# EAGLE design FlightComputerBoard1 (EAGLE 8.1.0)
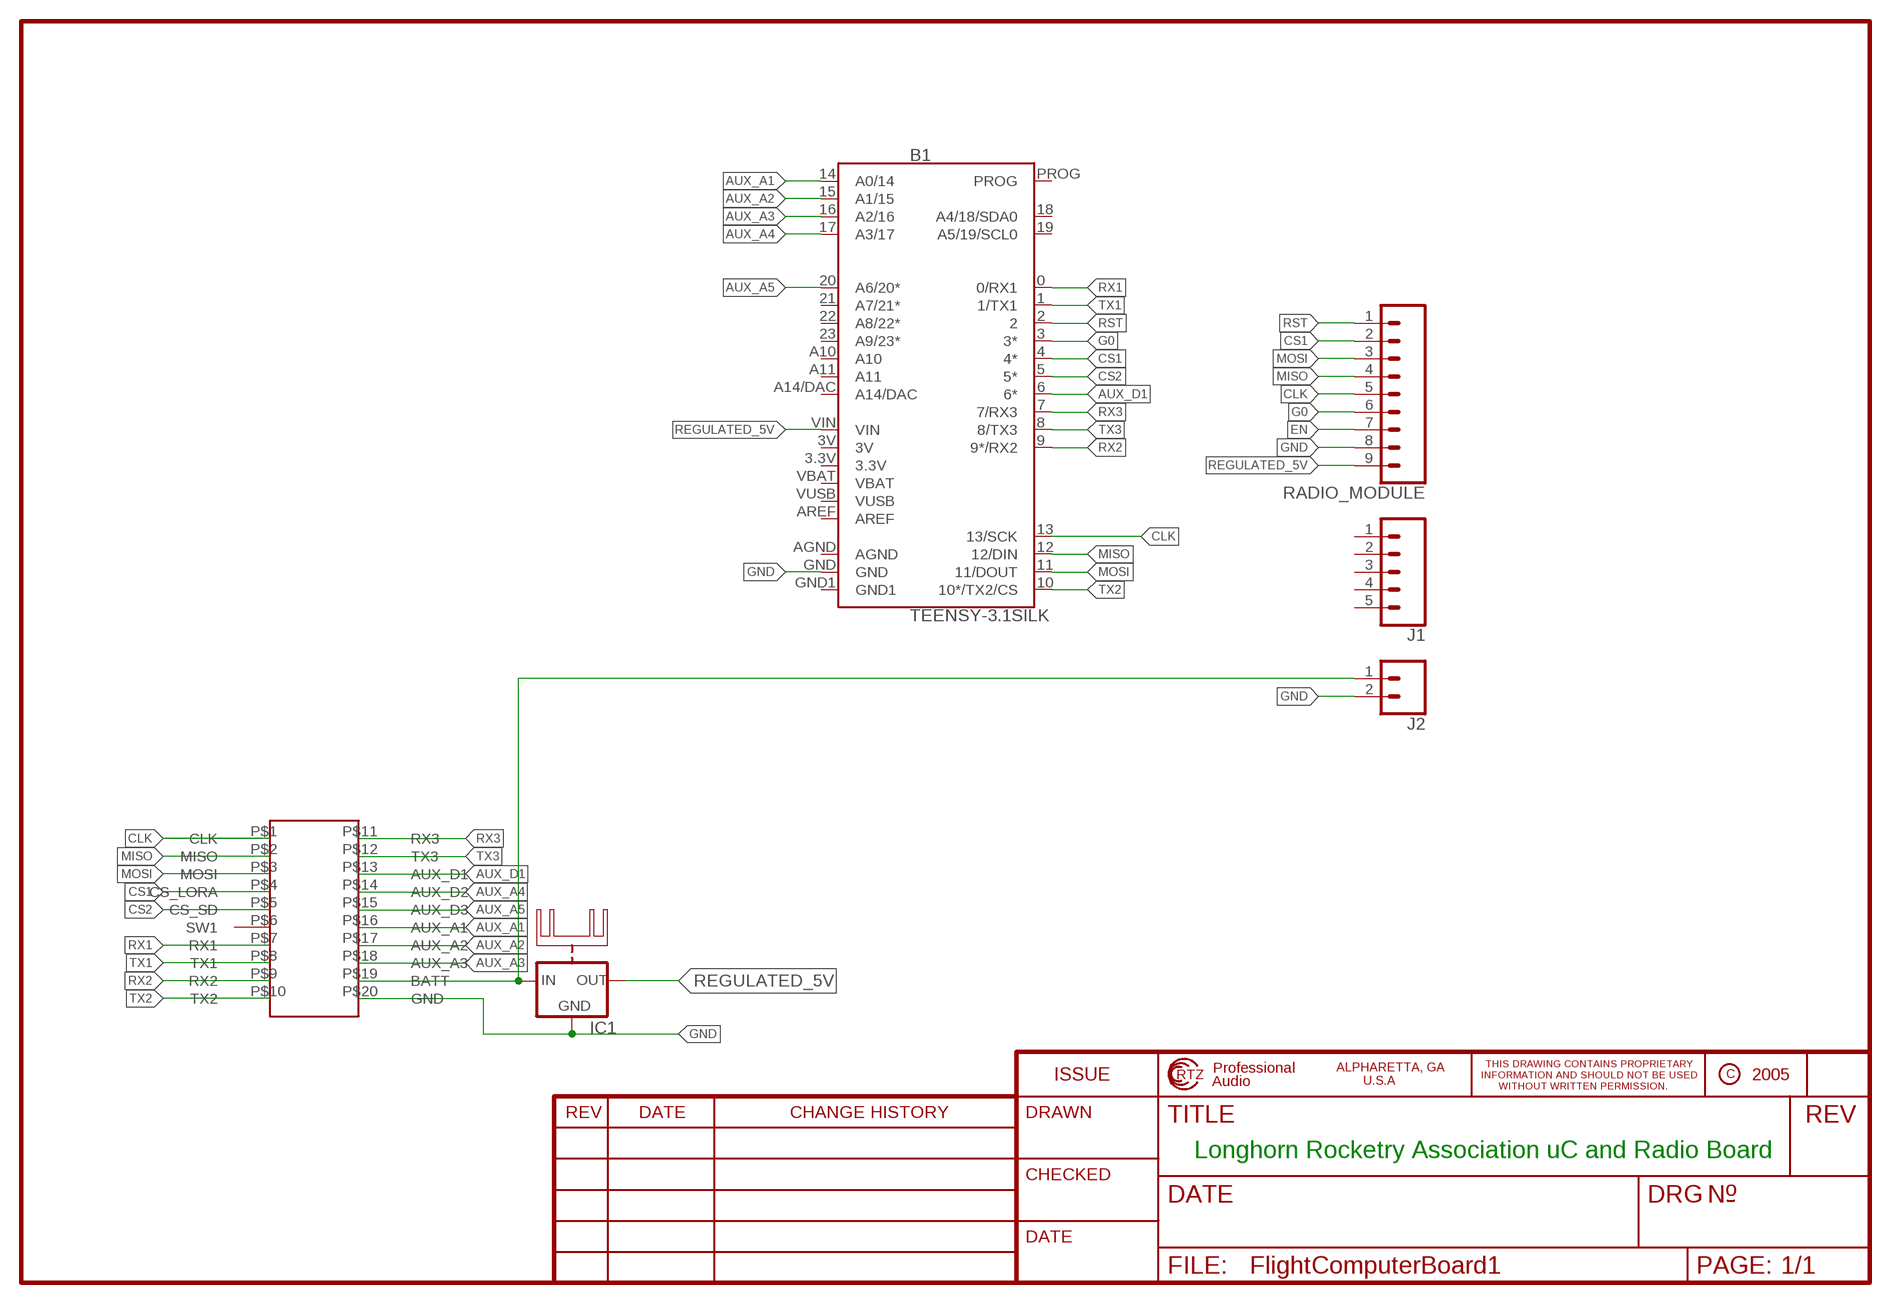
[diagram p0: schematic, sheet 1]

## Parts
B1  TEENSY-3.1SILK  [TEENSY-3.1]
IC1  78XXH  [78XXH]
J1  CONN_05  [1X05]
J2  CONN_02  [1X02]
RADIO_MODULE  CONN_09  [1X09]
U$1  SMALLHEADERPACKAGE  [SMALLHEADERPACKAGE]

## Nets
AUX_A1: B1.14(A0/14) U$1.P$16(AUX_A1)
AUX_A2: B1.15(A1/15) U$1.P$17(AUX_A2)
AUX_A3: B1.16(A2/16) U$1.P$18(AUX_A3)
AUX_A4: B1.17(A3/17) U$1.P$14(AUX_D2)
AUX_A5: B1.20(A6/20*) U$1.P$15(AUX_D3)
AUX_D1: B1.6(6*) U$1.P$13(AUX_D1)
CLK: B1.13(13/SCK) RADIO_MODULE.5 U$1.P$1(CLK)
CS1: B1.4(4*) RADIO_MODULE.2 U$1.P$4(CS_LORA)
CS2: B1.5(5*) U$1.P$5(CS_SD)
EN: RADIO_MODULE.7
G0: B1.3(3*) RADIO_MODULE.6
GND: B1.GND IC1.GND J2.2 RADIO_MODULE.8 U$1.P$20(GND)
MISO: B1.12(12/DIN) RADIO_MODULE.4 U$1.P$2(MISO)
MOSI: B1.11(11/DOUT) RADIO_MODULE.3 U$1.P$3(MOSI)
N$2: IC1.IN J2.1 U$1.P$19(BATT)
REGULATED_5V: B1.VIN IC1.OUT RADIO_MODULE.9
RST: B1.2 RADIO_MODULE.1
RX1: B1.0(0/RX1) U$1.P$7(RX1)
RX2: B1.9(9*/RX2) U$1.P$9(RX2)
RX3: B1.7(7/RX3) U$1.P$11(RX3)
TX1: B1.1(1/TX1) U$1.P$8(TX1)
TX2: B1.10(10*/TX2/CS) U$1.P$10(TX2)
TX3: B1.8(8/TX3) U$1.P$12(TX3)
Unconnected: B1.18(A4/18/SDA0) B1.19(A5/19/SCL0) B1.21(A7/21*) B1.22(A8/22*) B1.23(A9/23*) B1.A10 B1.A11 B1.A14/DAC B1.AREF B1.PROG J1.1 J1.2 J1.3 J1.4 J1.5 U$1.P$6(SW1)

## Notes on the sheet
- Longhorn Rocketry Association uC and Radio Board

## Power pins joined to a net without a drawn wire
3.3V: B1.3.3V
3V: B1.3V
AGND: B1.AGND
GND1: B1.GND1
VBAT: B1.VBAT
VUSB: B1.VUSB

## Library data of the parts
B1 = SparkFun-Boards:TEENSY-3.1: Teensy 3+ Footprint Mechanical footprint with connectors for Teensy Development Board with ARM Cortex. SparkFun Products: Teensy 3.2 <https://www.sparkfun.com/products/13736> Teensy LC <https://www.sparkfun.com/products/13305>; SF_ID: DEV-12646
IC1 = 78xx_with_heatsink:78XXH: VOLTAGE REGULATOR
J1 = SparkFun-Connectors:CONN_05: Multi connection point. Often used as Generic Header-pin footprint for 0.1 inch spaced/style header connections On any of the 0.1 inch spaced packages, you can populate with these: Break Away Headers - Straight <https://www.sparkfun.com/products/116> (PRT-00116) Break Away Male Headers - Right Angle <https://www.sparkfun.com/products/553> (PRT-00553) Female Headers <https://www.sparkfun.com/products/115> (PRT-00115) Break Away Headers - Machine Pin <https://www.sparkfun.com/products/117> (PRT-00117) Break Away Female Headers - Swiss Machine Pin <https://www.sparkfun.com/products/743> (PRT-00743) For SCREWTERMINALS and SPRING TERMINALS visit here: Screw Terimnals on SparkFun.com <https://www.sparkfun.com/search/results?term=Screw+Terminals> (5mm/3.5mm/2.54mm spacing) This device is also useful as a general connection point to wire up your design to another part of your project. Our various solder wires solder well into these plated through hole pads. Hook-Up Wire - Assortment (Stranded, 22 AWG) <https://www.sparkfun.com/products/11375> (PRT-11375) Hook-Up Wire - Assortment (Solid Core, 22 AWG) <https://www.sparkfun.com/products/11367> (PRT-11367) View the entire wire category on our website here <https://www.sparkfun.com/categories/141> Special notes: Molex polarized connector foot print use with SKU : PRT-08231 with associated crimp pins and housings. 1MM SMD Version SKU: PRT-10208
J2 = SparkFun-Connectors:CONN_02: Multi connection point. Often used as Generic Header-pin footprint for 0.1 inch spaced/style header connections On any of the 0.1 inch spaced packages, you can populate with these: Break Away Headers - Straight <https://www.sparkfun.com/products/116> (PRT-00116) Break Away Male Headers - Right Angle <https://www.sparkfun.com/products/553> (PRT-00553) Female Headers <https://www.sparkfun.com/products/115> (PRT-00115) Break Away Headers - Machine Pin <https://www.sparkfun.com/products/117> (PRT-00117) Break Away Female Headers - Swiss Machine Pin <https://www.sparkfun.com/products/743> (PRT-00743) For SCREWTERMINALS and SPRING TERMINALS visit here: Screw Terimnals on SparkFun.com <https://www.sparkfun.com/search/results?term=Screw+Terminals> (5mm/3.5mm/2.54mm spacing) This device is also useful as a general connection point to wire up your design to another part of your project. Our various solder wires solder well into these plated through hole pads. Hook-Up Wire - Assortment (Stranded, 22 AWG) <https://www.sparkfun.com/products/11375> (PRT-11375) Hook-Up Wire - Assortment (Solid Core, 22 AWG) <https://www.sparkfun.com/products/11367> (PRT-11367) View the entire wire category on our website here <https://www.sparkfun.com/categories/141> Special notes: Molex polarized connector foot print use with: PRT-08233 with associated crimp pins and housings. 2.54_SCREWTERM for use with PRT-10571. 3.5mm Screw Terminal footprints for PRT-08084 5mm Screw Terminal footprints for use with PRT-08432
RADIO_MODULE = SparkFun-Connectors:CONN_09: Multi connection point. Often used as Generic Header-pin footprint for 0.1 inch spaced/style header connections On any of the 0.1 inch spaced packages, you can populate with these: Break Away Headers - Straight <https://www.sparkfun.com/products/116> (PRT-00116) Break Away Male Headers - Right Angle <https://www.sparkfun.com/products/553> (PRT-00553) Female Headers <https://www.sparkfun.com/products/115> (PRT-00115) Break Away Headers - Machine Pin <https://www.sparkfun.com/products/117> (PRT-00117) Break Away Female Headers - Swiss Machine Pin <https://www.sparkfun.com/products/743> (PRT-00743) For SCREWTERMINALS and SPRING TERMINALS visit here: Screw Terimnals on SparkFun.com <https://www.sparkfun.com/search/results?term=Screw+Terminals> (5mm/3.5mm/2.54mm spacing) This device is also useful as a general connection point to wire up your design to another part of your project. Our various solder wires solder well into these plated through hole pads. Hook-Up Wire - Assortment (Stranded, 22 AWG) <https://www.sparkfun.com/products/11375> (PRT-11375) Hook-Up Wire - Assortment (Solid Core, 22 AWG) <https://www.sparkfun.com/products/11367> (PRT-11367) View the entire wire category on our website here <https://www.sparkfun.com/categories/141> Special notes: Molex polarized connector foot print use with SKU : PRT-08231 with associated crimp pins and housings. 1MM SMD Version SKU: PRT-10208 NOTES ON THE VARIANTS LOCK and LOCK_LONGPADS... This footprint was designed to help hold the alignment of a through-hole component (i.e. 6-pin header) while soldering it into place. You may notice that each hole has been shifted either up or down by 0.005 of an inch from it's more standard position (which is a perfectly straight line). This slight alteration caused the pins (the squares in the middle) to touch the edges of the holes. Because they are alternating, it causes a "brace" to hold the component in place. 0.005 has proven to be the perfect amount of "off-center" position when using our standard breakaway headers. Although looks a little odd when you look at the bare footprint, once you have a header in there, the alteration is very hard to notice. Also,if you push a header all the way into place, it is covered up entirely on the bottom side.
U$1 = LRA_FlightCPU_Connector:SMALLHEADERPACKAGE

## Board
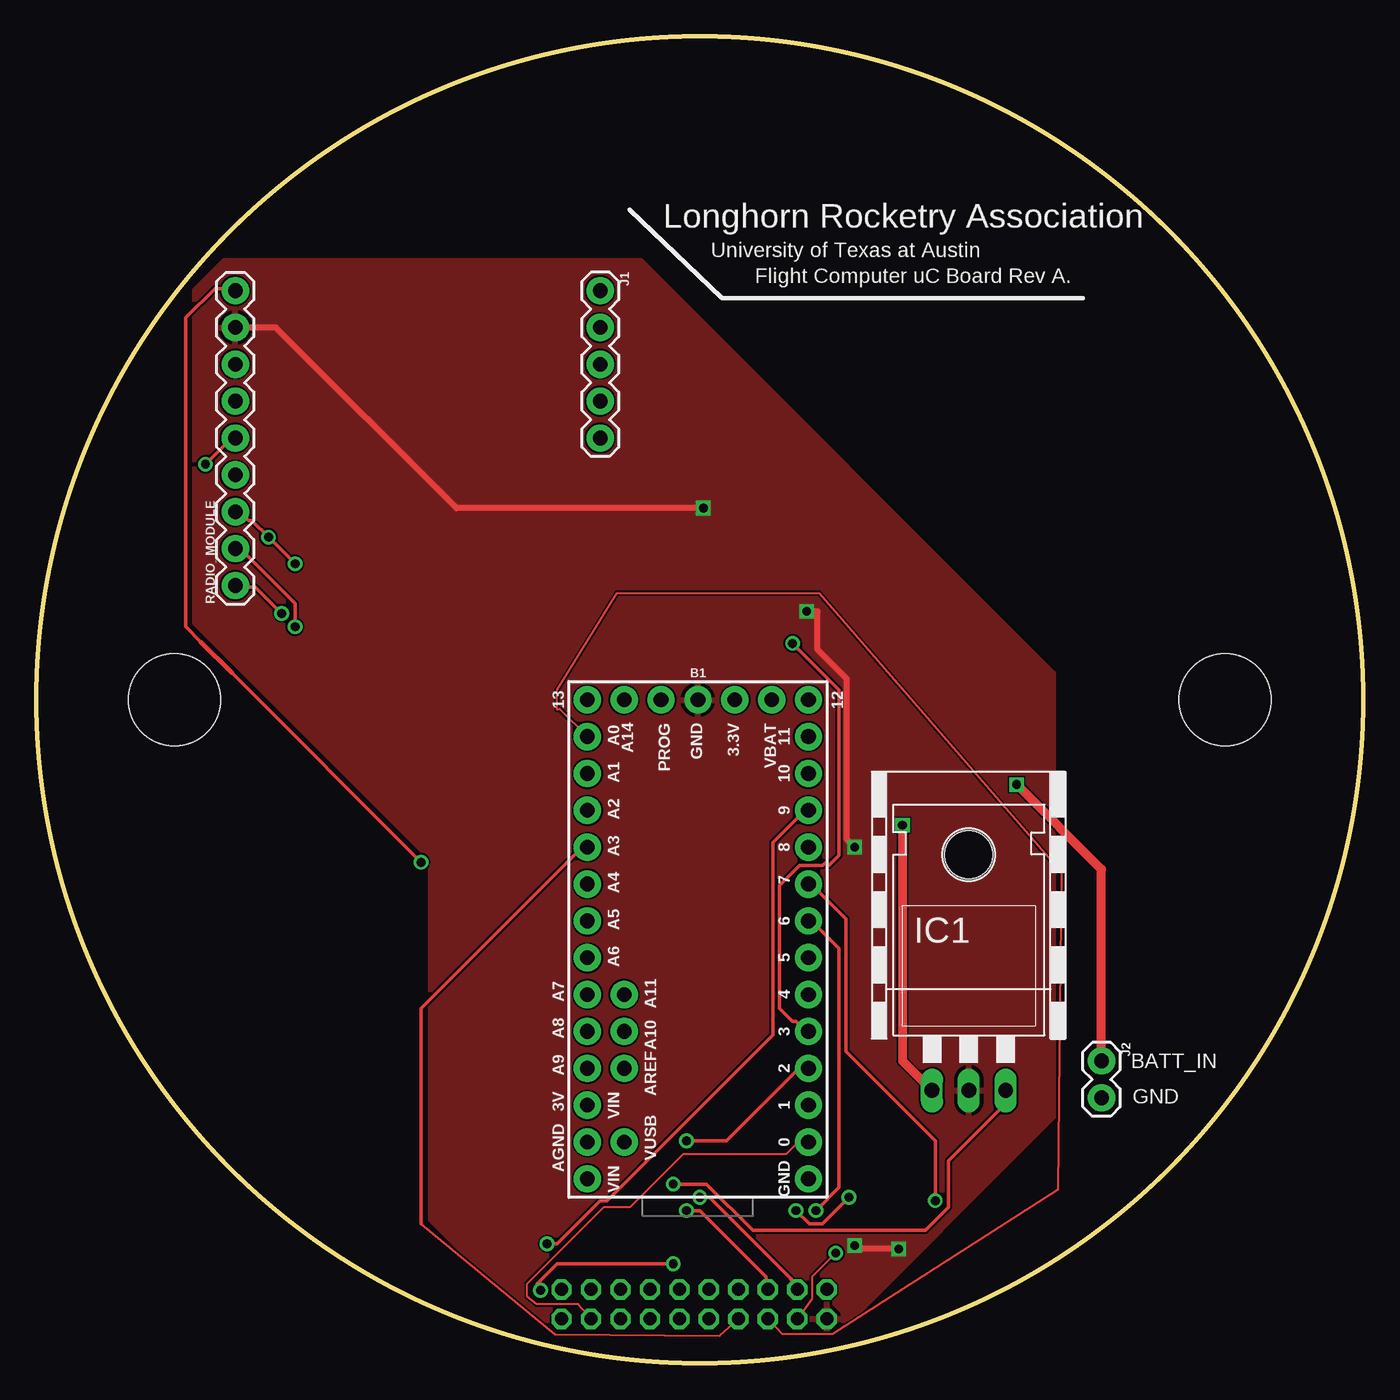
[diagram p1: board, top side]
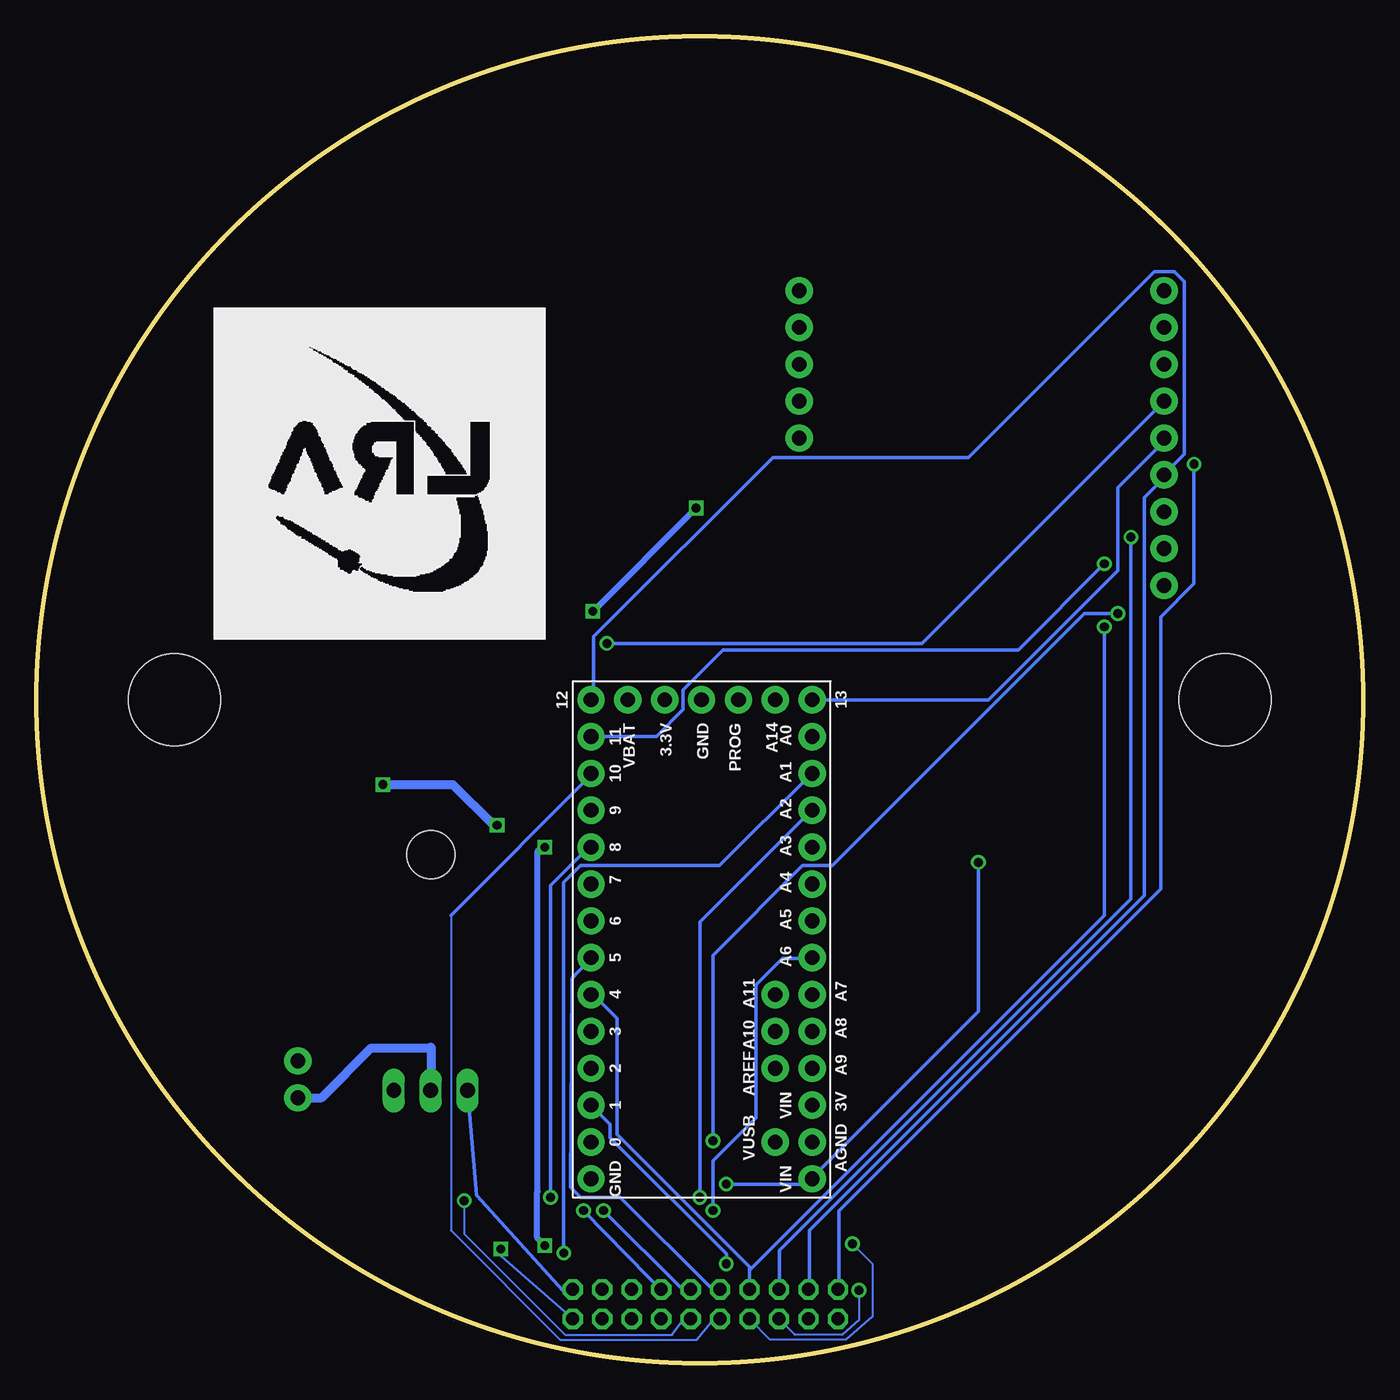
[diagram p2: board, bottom side, seen from below]

Size 91.44 x 91.44 mm. Coordinates in mm from the lower left corner, seen from the top.
Outline: circle at 45.72,45.72 radius 45.72
Copper layers (1*16): Top 0.035mm / dielectric 1.5mm / Bottom 0.035mm
Design rules "default *": minimum track width 3.5mil, minimum drill 16mil, track to track 5mil, track to pad 8mil, pad to pad 8mil, via to via 8mil, smd to smd 8mil, copper to edge 8mil, drill to drill 8mil, minimum pad ring 10mil, minimum via ring 8mil, stop-mask expansion 4mil, vias tented up to drill 0mil, thermal gap 10mil
Holes 6.35 mm at 9.53,45.72 81.92,45.72

### Footprints (pad centres in the part's own frame; a part is rotated, then mirrored left to right if it is on the bottom)
TEENSY-3.1 = drill 1.016 pad 1.88: 0 7.62,-13.97; 1 7.62,-11.43; 2 7.62,-8.89; 3 7.62,-6.35; 3.3V 2.54,16.51; 3V -7.62,-11.43; 4 7.62,-3.81; 5 7.62,-1.27; 6 7.62,1.27; 7 7.62,3.81; 8 7.62,6.35; 9 7.62,8.89; 10 7.62,11.43; 11 7.62,13.97; 12 7.62,16.51; 13 -7.62,16.51; 14 -7.62,13.97; 15 -7.62,11.43; 16 -7.62,8.89; 17 -7.62,6.35; 18 -7.62,3.81; 19 -7.62,1.27; 20 -7.62,-1.27; 21 -7.62,-3.81; 22 -7.62,-6.35; 23 -7.62,-8.89; A10 -5.08,-6.35; A11 -5.08,-3.81; A14/DAC -5.08,16.51; AGND -7.62,-13.97; AREF -5.08,-8.89; GND 0,16.51; GND1 7.62,-16.51; PROG -2.54,16.51; VBAT 5.08,16.51; VIN -7.62,-16.51; VUSB -5.08,-13.97
78XXH = drill 1.016 long: GND 0,-5.08; IN -2.54,-5.08; OUT 2.54,-5.08 | hole 3.302: 0,11.176
1X05 = drill 1.016 pad 1.88: 1 0,0; 2 2.54,0; 3 5.08,0; 4 7.62,0; 5 10.16,0
1X02 = drill 1.016 pad 1.88: 1 0,0; 2 2.54,0
1X09 = drill 1.016 pad 1.88: 1 0,0; 2 2.54,0; 3 5.08,0; 4 7.62,0; 5 10.16,0; 6 12.7,0; 7 15.24,0; 8 17.78,0; 9 20.32,0
SMALLHEADERPACKAGE = drill 0.9 octagon: P$1 0,0; P$2 0,2.032; P$3 0,4.064; P$4 0,6.096; P$5 0,8.128; P$6 2.032,0; P$7 2.032,2.032; P$8 2.032,4.064; P$9 2.032,6.096; P$10 2.032,8.128; P$11 2.032,10.16; P$12 0,10.16; P$13 0,12.192; P$14 2.032,12.192; P$15 0,14.224; P$16 2.032,14.224; P$17 2.032,16.256; P$18 0,16.256; P$19 0,18.288; P$20 2.032,18.288

### Placement (x,y rotation side)
B1  45.59,29.21 0 top
IC1  64.26,23.88 0 top
J1  38.86,73.91 270 top
J2  73.41,20.83 270 top
RADIO_MODULE  13.72,53.59 90 top
U$1  36.2,5.08 270 top

### Tracks (layer width: path | path; a pad name or v marks a point on that pad's centre or on a via)
AUX_A1
  Top 0.127: 35.89,45.03 35.89,45.09 | 35.89,45.09 35.89,46.41 40.01,53.06 53.95,53.06 70.64,33.83 70.38,11.94 54.86,2.01 51.41,2.01 U$1.P$16 | 35.89,45.09 36.07,45.09 B1.14
AUX_A2  (via drill 0.61)
  Top 0.127: v55.09,7.59 53.47,5.97 53.47,4.45 U$1.P$17
  Bottom 0.254: v55.09,7.59 55.09,33.15 53.95,34.29 44.35,34.29 38.18,40.46 B1.15
AUX_A3  (via drill 0.61)
  Top 0.254: v45.72,11.43 46.41,11.43 51.97,5.87 U$1.P$18
  Bottom 0.254: v45.72,11.43 45.72,30.4 38.18,37.95 B1.16
AUX_A4
  Top 0.127: 26.52,9.6 35.76,2.01 47.09,1.88 U$1.P$14
  Top 0.254: 26.52,9.6 26.52,24.46 37.49,35.43 37.95,35.43 B1.17
AUX_A5  (via drill 0.61)
  Top 0.254: v44.81,10.52 45.72,10.52 50.29,5.94 U$1.P$15
  Bottom 0.254: v44.81,10.52 44.81,13.95 41.83,16.92 41.83,26.06 40.01,27.89 38.18,27.89 B1.20
AUX_D1  (via drill 0.61)
  Top 0.254: v53.72,10.52 55.32,12.12 55.32,28.57 53.26,30.63 B1.6
  Bottom 0.254: v53.72,10.52 49.23,5.89 U$1.P$13
CLK  (via drill 0.61)
  Top 0.254: v11.66,61.95 13.26,63.55 13.72,63.55 RADIO_MODULE.5
  Bottom 0.254: v11.66,61.95 11.66,53.72 13.95,51.44 13.95,32.69 36.12,10.52 36.12,5.26 U$1.P$1 | B1.13 25.83,45.72 16.92,54.63 16.92,60.35 13.72,63.55 RADIO_MODULE.5
CS1  (via drill 0.61)
  Top 0.254: v17.83,50.75 17.83,52.35 14.17,56.01 13.72,56.01 RADIO_MODULE.2
  Bottom 0.254: 42.29,6.4 42.29,6.63 51.44,15.77 51.44,23.77 53.03,25.38 B1.4 | 42.29,6.4 U$1.P$4 | v17.83,50.75 17.83,30.86 42.29,6.4
CS2
  Bottom 0.254: B1.5 54.51,26.52 54.63,12.12 53.95,11.43 51.21,11.43 44.86,5.08 U$1.P$5
G0  (via drill 0.61)
  Top 0.254: v52.12,49.61 55.32,46.41 55.32,34.98 54.63,34.29 54.41,34.52 54.18,34.29 52.58,34.29 51.21,32.92 51.21,24.46 52.12,23.55 52.35,23.55 53.03,22.86 B1.3
  Bottom 0.254: v52.12,49.61 30.4,49.61 RADIO_MODULE.6
GND  (via drill 0.6)
  Top 0.406: v59.44,7.87 56.13,7.87 | 56.13,7.87 | 56.13,7.87 56.39,7.87 v56.39,8.1 | v56.39,35.56 55.85,36.09 55.85,47.17 53.85,49.17 53.85,51.82 v53.09,51.82 | v45.97,58.93 28.96,58.93 16.51,71.37 RADIO_MODULE.8
  Bottom 0.127: U$1.P$20 59.69,7.62 59.44,7.62 v59.44,7.87
  Bottom 0.406: v56.39,8.1 56.92,8.64 56.92,11.81 56.9,11.83 56.9,35.31 56.39,35.31 v56.39,35.56 | v53.09,51.82 v45.97,58.93 | v45.97,58.93 45.72,59.18 45.97,59.18 v45.97,58.93
  Bottom 0.61: J2.2 71.78,18.29 68.35,21.72 64.31,21.72 64.24,21.79 64.24,18.82 IC1.GND
  pour Top: 45.72,1.52 54.61,1.52 70.1,17.02 70.1,47.5 41.66,75.95 12.95,75.95 10.92,73.91 10.92,51.05 27.18,34.8 27.18,9.91 35.31,1.78 45.47,1.78
MISO
  Bottom 0.254: U$1.P$2 38.18,5.26 38.18,9.14 15.09,32.23 15.09,59.66 13.72,61.04 RADIO_MODULE.4 13.72,61.27 12.34,62.64 12.34,74.52 13.03,75.21 14.4,75.21 27.2,62.41 40.69,62.41 53.03,50.06 53.03,45.72 B1.12
MOSI  (via drill 0.61)
  Top 0.254: RADIO_MODULE.3 13.72,58.52 14.17,58.52 14.63,58.06 14.86,58.06 v16,56.92 v17.83,55.09
  Bottom 0.254: v16,56.92 16,32 40.23,7.77 40.23,5.26 U$1.P$3 | v17.83,55.09 23.77,49.15 44.12,49.15 46.86,46.41 46.86,45.03 48.69,43.2 53.03,43.2 B1.11
N$2  (via drill 0.6)
  Top 0.61: J2.1 73.41,34.04 v67.56,39.88 | v59.69,37.08 59.69,20.83 IC1.IN
  Bottom 0.254: IC1.IN 61.09,11.58 55.14,5 U$1.P$19
  Bottom 0.61: v67.56,39.88 62.74,39.88 59.94,37.08 v59.69,37.08
REGULATED_5V  (via drill 0.61)
  Top 0.254: v43.89,12.34 46.18,12.34 49.38,9.14 61.27,9.14 62.87,10.74 62.87,13.95 66.75,17.83 66.75,18.75 IC1.OUT | 11.43,49.61 11.34,49.7 10.29,50.75 10.29,72.03 12.32,74.07 13.72,74.07 RADIO_MODULE.9 | 13.49,47.55 v26.52,34.52
  Top 0.305: 11.34,49.7 13.49,47.55
  Bottom 0.254: v43.89,12.34 38.41,12.34 38.18,12.57 B1.VIN 37.95,12.8 26.52,24.23 v26.52,34.52
RST  (via drill 0.61)
  Top 0.254: v16.92,51.66 15.09,53.49 13.72,53.49 RADIO_MODULE.1 | v44.81,15.32 47.55,15.32 52.35,20.12 53.03,20.12 B1.2
  Bottom 0.254: v16.92,51.66 19.2,51.66 36.58,34.29 38.63,34.29 44.81,28.12 v44.81,15.32
RX1
  Top 0.127: B1.0 53.03,15.09 52.35,15.09 51.66,14.4 44.58,14.4 40.92,10.74 39.09,10.74 33.83,5.49 33.83,4.57 34.47,4.06 37.34,4.06 U$1.P$7
RX2  (via drill 0.61)
  Top 0.254: v35.2,8.23 35.89,8.23 38.86,11.2 39.32,11.2 50.75,22.63 50.75,35.89 53.03,38.18 B1.9
  Bottom 0.127: v35.2,8.23 33.83,6.86 33.83,3.2 35.66,1.63 40.87,1.63 U$1.P$9
RX3  (via drill 0.61)
  Top 0.254: v61.95,11.2 61.95,15.32 55.78,21.49 55.78,30.63 53.26,33.15 B1.7
  Bottom 0.127: v61.95,11.2 61.95,8.91 54.99,1.96 47.62,1.96 46.86,2.97 46.41,2.97 U$1.P$11
TX1  (via drill 0.61)
  Top 0.254: v34.75,5.03 34.52,5.26 34.52,5.49 35.89,6.86 v43.89,6.86
  Bottom 0.127: v34.75,5.03 34.75,2.97 35.89,1.96 39.17,1.96 U$1.P$8
  Bottom 0.254: v43.89,6.86 43.89,7.54 51.89,15.54 51.89,16.46 B1.1
TX2
  Bottom 0.127: 62.87,30.86 62.87,9.14 55.35,1.63 45.9,1.63 44.81,2.97 44.35,2.97 U$1.P$10
  Bottom 0.254: 62.87,30.86 53.26,40.46 B1.10
TX3  (via drill 0.61)
  Top 0.254: v52.35,10.52 53.26,9.6 54.18,9.6 v56.01,11.43
  Bottom 0.254: v56.01,11.43 56.01,32.92 53.26,35.66 B1.8 | U$1.P$12 46.91,5.08 v52.35,10.52

### Text on the board
tPlace: Longhorn Rocketry Association | University of Texas at Austin | Flight Computer uC Board Rev A. | BATT_IN | GND